# Altium schematic sheet GD32F450_Main_Board(Camera)_V1.0.SchDoc
size A4
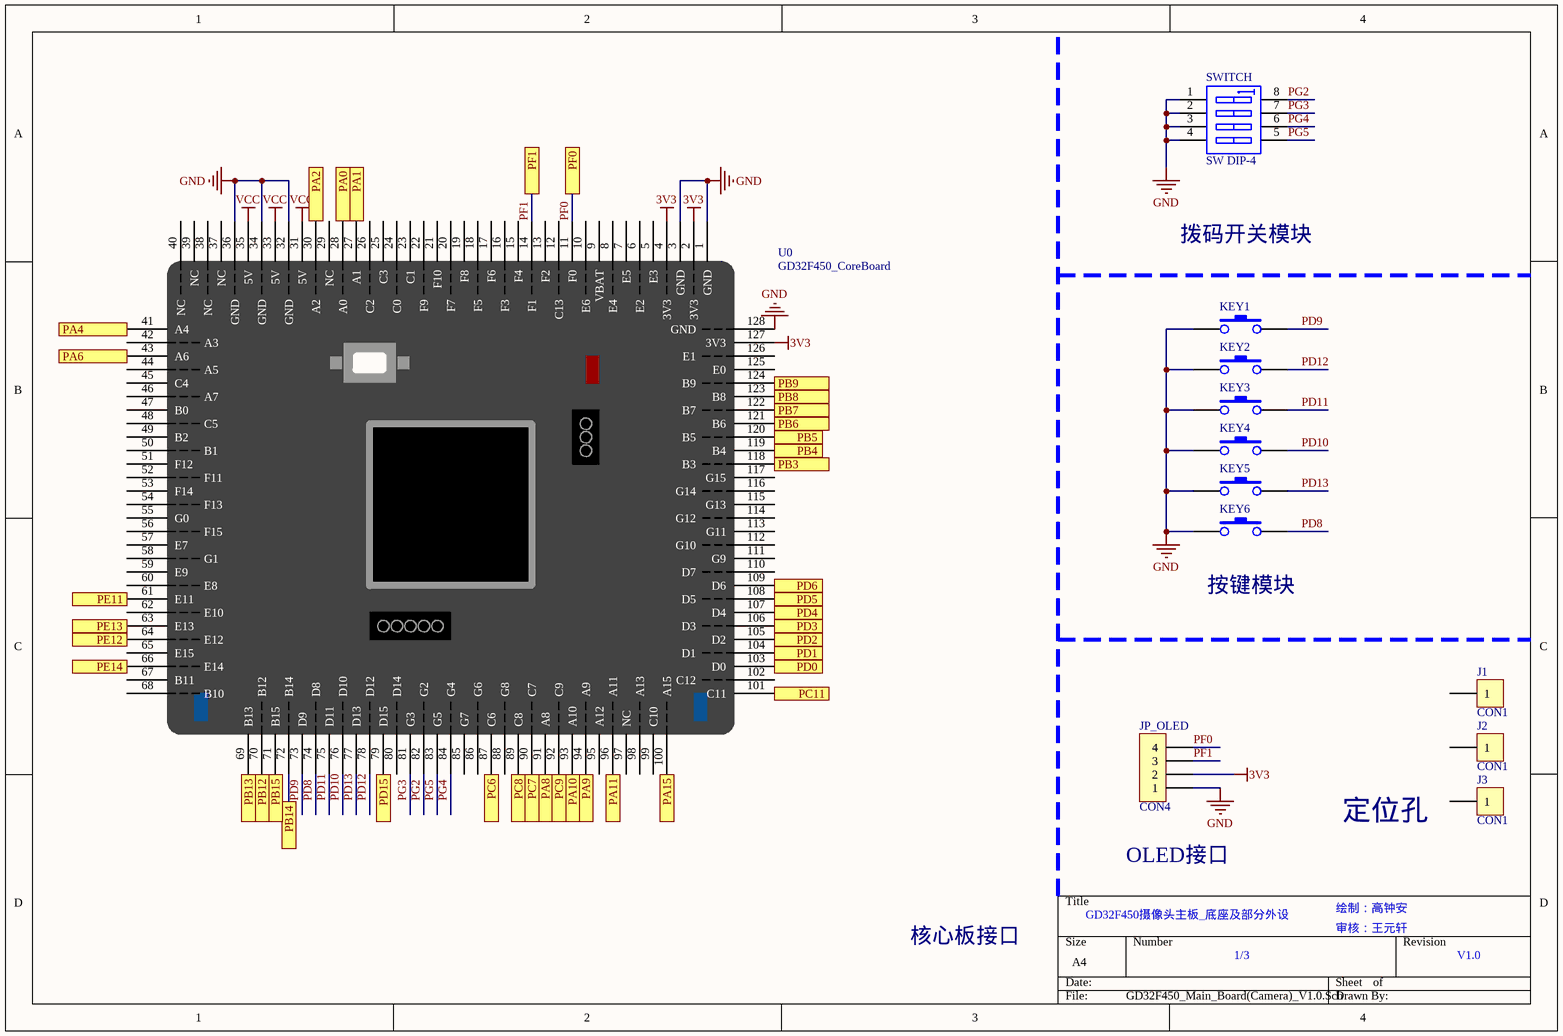
[diagram p0: GD32F450_Main_Board(Camera)_V1.0.SchDoc]

## Parts
J1  CON1  [HOLE-3.5]
J2  CON1  [HOLE-3.5]
J3  CON1  [HOLE-3.5]
JP_OLED  CON4  [OLED]
KEY1  SW-PB  [KEY2-6X3]  (value not drawn)
KEY2  SW-PB  [KEY2-6X3]  (value not drawn)
KEY3  SW-PB  [KEY2-6X3]  (value not drawn)
KEY4  SW-PB  [KEY2-6X3]  (value not drawn)
KEY5  SW-PB  [KEY2-6X3]  (value not drawn)
KEY6  SW-PB  [KEY2-6X3]  (value not drawn)
SWITCH  SW DIP-4  [CSW DIP-4P]
U0  GD32F450_CoreBoard  [GD32F450_CoreBoard]

## Ports
PA0, PA1, PA2, PA4, PA6, PA8, PA9, PA10, PA11, PA15, PB3, PB4, PB5, PB6, PB7, PB8, PB9, PB12, PB13, PB14, PB15, PC6, PC7, PC8, PC9, PC11, PD0, PD1, PD2, PD3, PD4, PD5, PD6, PD15, PE11, PE12, PE13, PE14, PF0, PF1

## Nets
3V3: JP_OLED.2 U0.2(3V3) U0.4(3V3) U0.127(3V3)
GND: JP_OLED.1 KEY1.1 KEY2.1 KEY3.1 KEY4.1 KEY5.1 KEY6.1 SWITCH.1(A1) SWITCH.2(A2) SWITCH.3(A3) SWITCH.4(A4) U0.1(GND) U0.3(GND) U0.32(GND) U0.34(GND) U0.36(GND) U0.128(GND)
VCC: U0.31(5V) U0.33(5V) U0.35(5V)
PA0: U0.28(A0) ; port PA0
PA1: U0.27(A1) ; port PA1
PA2: U0.30(A2) ; port PA2
PA4: U0.41(A4) ; port PA4
PA6: U0.43(A6) ; port PA6
PA8: U0.91(A8) ; port PA8
PA9: U0.94(A9) ; port PA9
PA10: U0.93(A10) ; port PA10
PA11: U0.96(A11) ; port PA11
PA15: U0.100(A15) ; port PA15
PB3: U0.118(B3) ; port PB3
PB4: U0.119(B4) ; port PB4
PB5: U0.120(B5) ; port PB5
PB6: U0.121(B6) ; port PB6
PB7: U0.122(B7) ; port PB7
PB8: U0.123(B8) ; port PB8
PB9: U0.124(B9) ; port PB9
PB12: U0.70(B12) ; port PB12
PB13: U0.69(B13) ; port PB13
PB14: U0.72(B14) ; port PB14
PB15: U0.71(B15) ; port PB15
PC6: U0.87(C6) ; port PC6
PC7: U0.90(C7) ; port PC7
PC8: U0.89(C8) ; port PC8
PC9: U0.92(C9) ; port PC9
PC11: U0.101(C11) ; port PC11
PD0: U0.103(D0) ; port PD0
PD1: U0.104(D1) ; port PD1
PD2: U0.105(D2) ; port PD2
PD3: U0.106(D3) ; port PD3
PD4: U0.107(D4) ; port PD4
PD5: U0.108(D5) ; port PD5
PD6: U0.109(D6) ; port PD6
PD8: KEY6.2 U0.74(D8)
PD9: KEY1.2 U0.73(D9)
PD10: KEY4.2 U0.76(D10)
PD11: KEY3.2 U0.75(D11)
PD12: KEY2.2 U0.78(D12)
PD13: KEY5.2 U0.77(D13)
PD15: U0.79(D15) ; port PD15
PE11: U0.61(E11) ; port PE11
PE12: U0.64(E12) ; port PE12
PE13: U0.63(E13) ; port PE13
PE14: U0.66(E14) ; port PE14
PF0: JP_OLED.4 U0.11(F0) ; port PF0
PF1: JP_OLED.3 U0.14(F1) ; port PF1
PG2: SWITCH.8(B1) U0.82(G2)
PG3: SWITCH.7(B2) U0.81(G3)
PG4: SWITCH.6(B3) U0.84(G4)
PG5: SWITCH.5(B4) U0.83(G5)

Not connected (* = marked no-connect by the designer): J1 1; J2 1; J3 1; U0 5(E3) 6(E2) 7(E5) 8(E4) 9(VBAT) 10(E6) 12(C13) 13(F2) 15(F4) 16(F3) 17(F6) 18(F5) 19(F8) 20(F7) 21(F10) 22(F9) 23(C1) 24(C0) 25(C3) 26(C2) 29(NC) 37(NC) 38(NC) 39(NC) 40(NC) 42(A3) 44(A5) 45(C4) 46(A7) 47(B0) 48(C5) 49(B2) 50(B1) 51(F12) 52(F11) 53(F14) 54(F13) 55(G0) 56(F15) 57(E7) 58(G1) 59(E9) 60(E8) 62(E10) 65(E15) 67(B11) 68(B10) 80(D14) 85(G7) 86(G6) 88(G8) 95(A12) 97(NC) 98(A13) 99(C10) 102(C12) 110(D7) 111(G9) 112(G10) 113(G11) 114(G12) 115(G13) 116(G14) 117(G15) 125(E0) 126(E1)

## Notes on the sheet
- 拨码开关模块
- (near KEY6) 按键模块
- 定位孔
- GD32F450摄像头主板_底座及部分外设
- OLED接口
- 绘制：高钟安
- 核心板接口
- 1/3
- 审核：王元轩
- V1.0

## Library data of the parts
J1-J3 = CON1: Connector
JP_OLED = CON4: Connector
SWITCH = SW DIP-4: DIP Switch